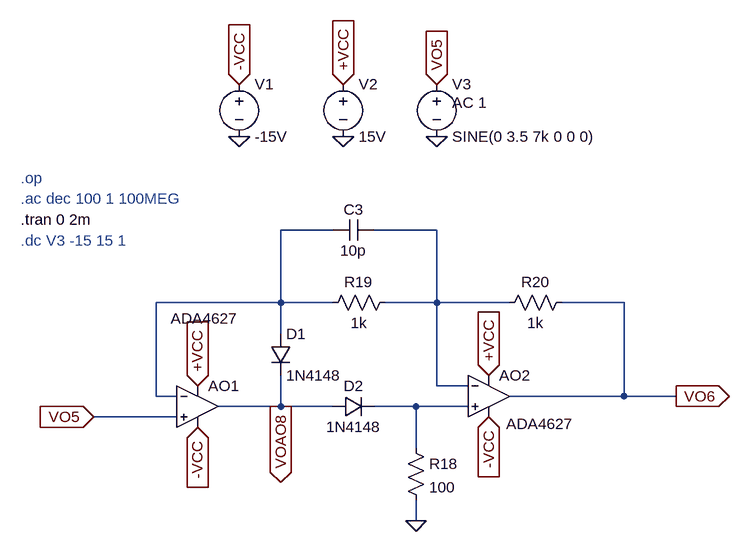
[diagram p0: schematic FWR.asc]
FWR.asc, the LTspice schematic file:
Version 4.1
SHEET 1 880 680
WIRE 192 -96 112 -96
WIRE 352 -96 256 -96
WIRE 112 16 112 -96
WIRE 112 16 -80 16
WIRE 192 16 112 16
WIRE 352 16 352 -96
WIRE 352 16 272 16
WIRE 464 16 352 16
WIRE 640 16 544 16
WIRE 112 64 112 16
WIRE 352 144 352 16
WIRE 400 144 352 144
WIRE -80 160 -80 16
WIRE -48 160 -80 160
WIRE 640 160 640 16
WIRE 640 160 464 160
WIRE 720 160 640 160
WIRE 112 176 112 128
WIRE 112 176 16 176
WIRE 192 176 112 176
WIRE 320 176 256 176
WIRE 400 176 320 176
WIRE -48 192 -176 192
WIRE 320 240 320 176
WIRE 320 352 320 320
FLAG 48 -240 0
FLAG 208 -240 0
FLAG 208 -320 +VCC
IOPIN 208 -320 In
FLAG 48 -320 -VCC
IOPIN 48 -320 In
FLAG 352 -240 0
FLAG 352 -320 VO5
IOPIN 352 -320 In
FLAG -176 192 VO5
IOPIN -176 192 In
FLAG -16 208 -VCC
IOPIN -16 208 In
FLAG -16 144 +VCC
IOPIN -16 144 In
FLAG 320 352 0
FLAG 432 128 +VCC
IOPIN 432 128 In
FLAG 432 192 -VCC
IOPIN 432 192 In
FLAG 720 160 VO6
IOPIN 720 160 Out
FLAG 112 176 VOAO8
IOPIN 112 176 Out
SYMBOL voltage 48 -336 R0
WINDOW 123 0 0 Left 0
WINDOW 39 0 0 Left 0
SYMATTR InstName V1
SYMATTR Value -15V
SYMBOL voltage 208 -336 R0
WINDOW 123 24 44 Left 2
WINDOW 39 0 0 Left 0
SYMATTR InstName V2
SYMATTR Value 15V
SYMBOL voltage 352 -336 R0
WINDOW 123 24 44 Left 2
WINDOW 39 0 0 Left 0
SYMATTR Value2 AC 1
SYMATTR InstName V3
SYMATTR Value SINE(0 3.5 7k 0 0 0)
SYMBOL OpAmps\\ADA4627 -16 112 R0
WINDOW 3 -41 -72 Left 2
SYMATTR InstName AO1
SYMBOL res 304 224 R0
SYMATTR InstName R18
SYMATTR Value 100
SYMBOL res 288 0 R90
WINDOW 0 0 56 VBottom 2
WINDOW 3 32 56 VTop 2
SYMATTR InstName R19
SYMATTR Value 1k
SYMBOL OpAmps\\ADA4627 432 96 R0
WINDOW 3 27 107 Left 2
SYMATTR InstName AO2
SYMBOL res 560 0 R90
WINDOW 0 0 56 VBottom 2
WINDOW 3 32 56 VTop 2
SYMATTR InstName R20
SYMATTR Value 1k
SYMBOL diode 96 64 R0
SYMATTR InstName D1
SYMATTR Value 1N4148
SYMBOL diode 192 192 R270
WINDOW 0 32 32 VTop 2
WINDOW 3 0 32 VBottom 2
SYMATTR InstName D2
SYMATTR Value 1N4148
SYMBOL cap 256 -112 R90
WINDOW 0 0 32 VBottom 2
WINDOW 3 32 32 VTop 2
SYMATTR InstName C3
SYMATTR Value 10p
TEXT -288 -144 Left 2 ;.ac dec 100 1 100MEG
TEXT -288 -112 Left 2 !.tran 0 2m
TEXT -288 -176 Left 2 ;.op
TEXT -288 -80 Left 2 ;.dc V3 -15 15 1

The netlist it stands for:
* FWR.asc
V1 -VCC 0 -15V
V2 +VCC 0 15V
V3 VO5 0 SINE(0 3.5 7k 0 0 0) AC 1
X§AO1 VO5 N001 +VCC -VCC VOAO8 ADA4627  ; pins In+ In- V+ V- OUT
R18 N003 0 100
R19 N002 N001 1k
X§AO2 N003 N002 +VCC -VCC VO6 ADA4627  ; pins In+ In- V+ V- OUT
R20 VO6 N002 1k
D1 N001 VOAO8 1N4148
D2 VOAO8 N003 1N4148
C3 N002 N001 10p
.model D D
.lib standard.dio
* .ac dec 100 1 100MEG
.tran 0 2m
* .op
* .dc V3 -15 15 1
.backanno
.end